# EAGLE design V0.2 (EAGLE 8.6.3)

## Sheet 1 of 3: This sheet contain connections for Power Source and +3.3 V regulator to enable communication.
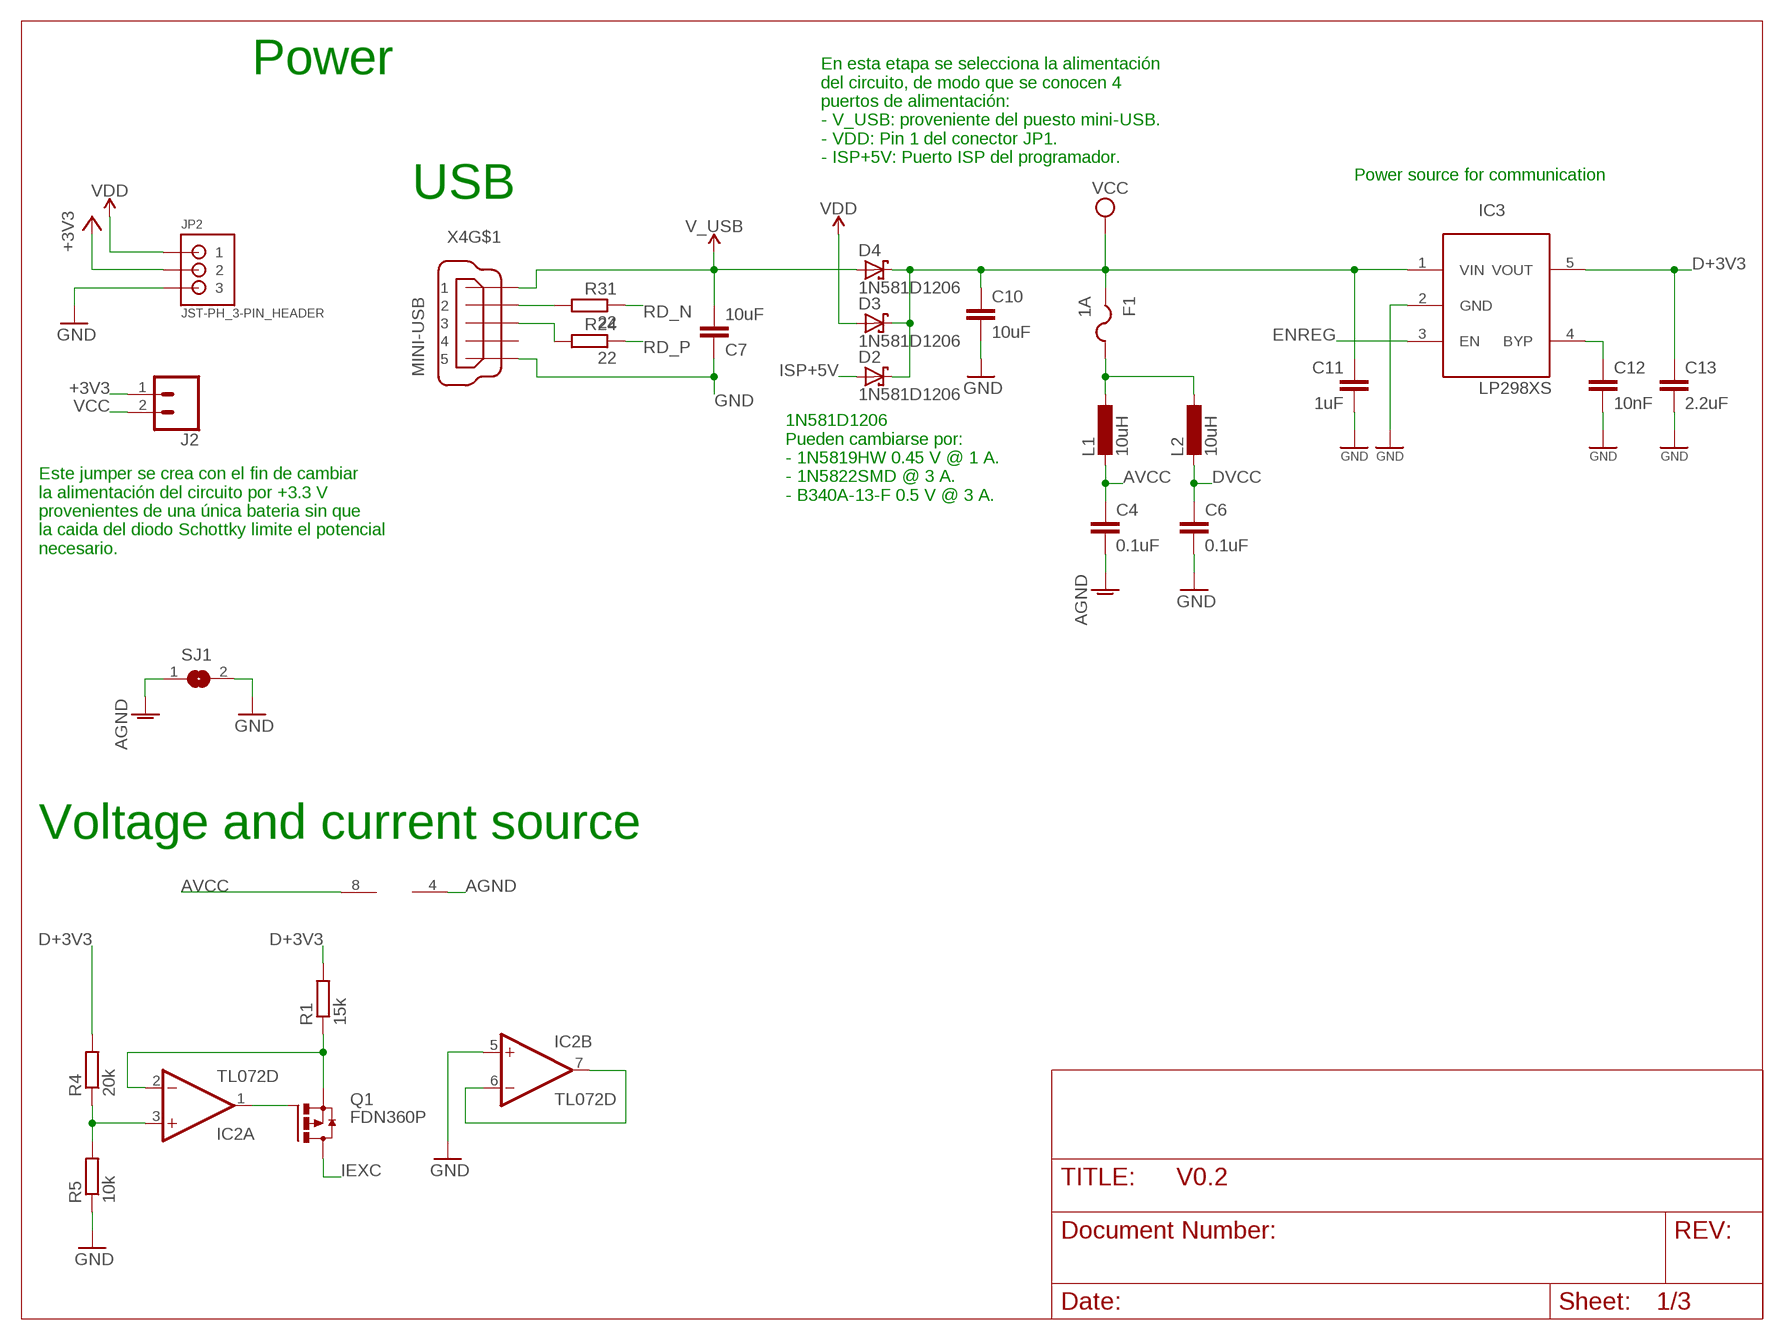
[diagram p0: schematic, sheet 1]

### Parts
C4  0.1uF  C-EUC0805  [C0805]
C6  0.1uF  C-EUC0805  [C0805]
C7  10uF  C-EUC0805  [C0805]
C10  10uF  C-EUC1206  [C1206]
C11  1uF  C-EUC0805  [C0805]
C12  10nF  C-EUC0805  [C0805]
C13  2.2uF  C-EUC0805  [C0805]
D2  1N581D1206  [LED-1206]
D3  1N581D1206  [LED-1206]
D4  1N581D1206  [LED-1206]
F1  1A  PTCFUSE-1812  [1812]
IC2  TL072D  [SO08]
IC3  LP298XS  [SOT23-5L]
J2  CONN_02  [1X02]
JP2  JST-PH_3-PIN_HEADER  [JST_B3B-PH_HEADER]
L1  10uH  L-EUL1812  [L1812]
L2  10uH  L-EUL1812  [L1812]
Q1  FDN360P  [SUPER-SOT3]
R1  15k  R-EU_R0805  [R0805]
R4  20k  R-EU_R0805  [R0805]
R5  10k  R-EU_R0805  [R0805]
R24  22  R-EU_R0805  [R0805]
R31  22  R-EU_R0805  [R0805]
SJ1  SJ  [SJ]
X4  MINI-USB  MINI-USB-SCHIELD-32005-201  [32005-201]

### Nets
+3V3 [power]: J2.1 JP2.P2
AGND: C4.2 IC2.4(P:V-) SJ1.1 ; also sheet 3
AVCC: C4.1 IC2.8(P:V+) L1.2
D+3V3 [power]: C13.1 IC3.5(VOUT) R1.2 R4.2 ; also sheet 3
D+USB: R24.2 X4.3
D-USB: R31.2 X4.2
DVCC: C6.1 L2.2 ; also sheet 2,3
ENREG: IC3.3(EN) ; also sheet 3
GND [power]: C6.2 C7.1 C10.2 C11.2 C12.2 C13.2 IC2.5(B:+IN) IC3.2(GND) JP2.P3 R5.1 SJ1.2 X4.5 ; also sheet 2,3
IEXC: Q1.3(D) ; also sheet 3
ISP+5V [power]: D2.A ; also sheet 3
N$1 [power]: F1.2 L1.1 L2.1
N$2: IC2.1(A:OUT) Q1.1(G)
N$4: IC2.3(A:+IN) R4.1 R5.2
N$5: IC2.2(A:-IN) Q1.2(S) R1.1
N$6: C12.1 IC3.4(BYP)
N$8: IC2.6(B:-IN) IC2.7(B:OUT)
RD_N: R31.1 ; also sheet 3
RD_P: R24.1 ; also sheet 3
V_USB [power]: C7.2 D4.A X4.1 ; also sheet 3
VCC [power]: C10.1 C11.1 D2.C D3.C D4.C F1.1 IC3.1(VIN) J2.2 ; also sheet 2
VDD [power]: D3.A JP2.P1
Unconnected: X4.4 X4.M1(S:S1) X4.M2(S:S2) X4.M3(S:S3) X4.M4(S:S4)

### Notes on the sheet
- Power
- En esta etapa se selecciona la alimentación 
  del circuito, de modo que se conocen 4
  puertos de alimentación:
  - V_USB: proveniente del puesto mini-USB.
  - VDD: Pin 1 del conector JP1.
  - ISP+5V: Puerto ISP del programador.
- Power source for communication
- USB
- 1N581D1206
  Pueden cambiarse por:
  - 1N5819HW 0.45 V @ 1 A.
  - 1N5822SMD @ 3 A.
  - B340A-13-F 0.5 V @ 3 A.
- Este jumper se crea con el fin de cambiar 
  la alimentación del circuito por +3.3 V 
  provenientes de una única bateria sin que 
  la caida del diodo Schottky limite el potencial 
  necesario.
- Voltage and current source

## Sheet 2 of 3: This sheet contain all conections for analog and digital sensors, display communication, antenna ports and conductive buttons for local configuration.
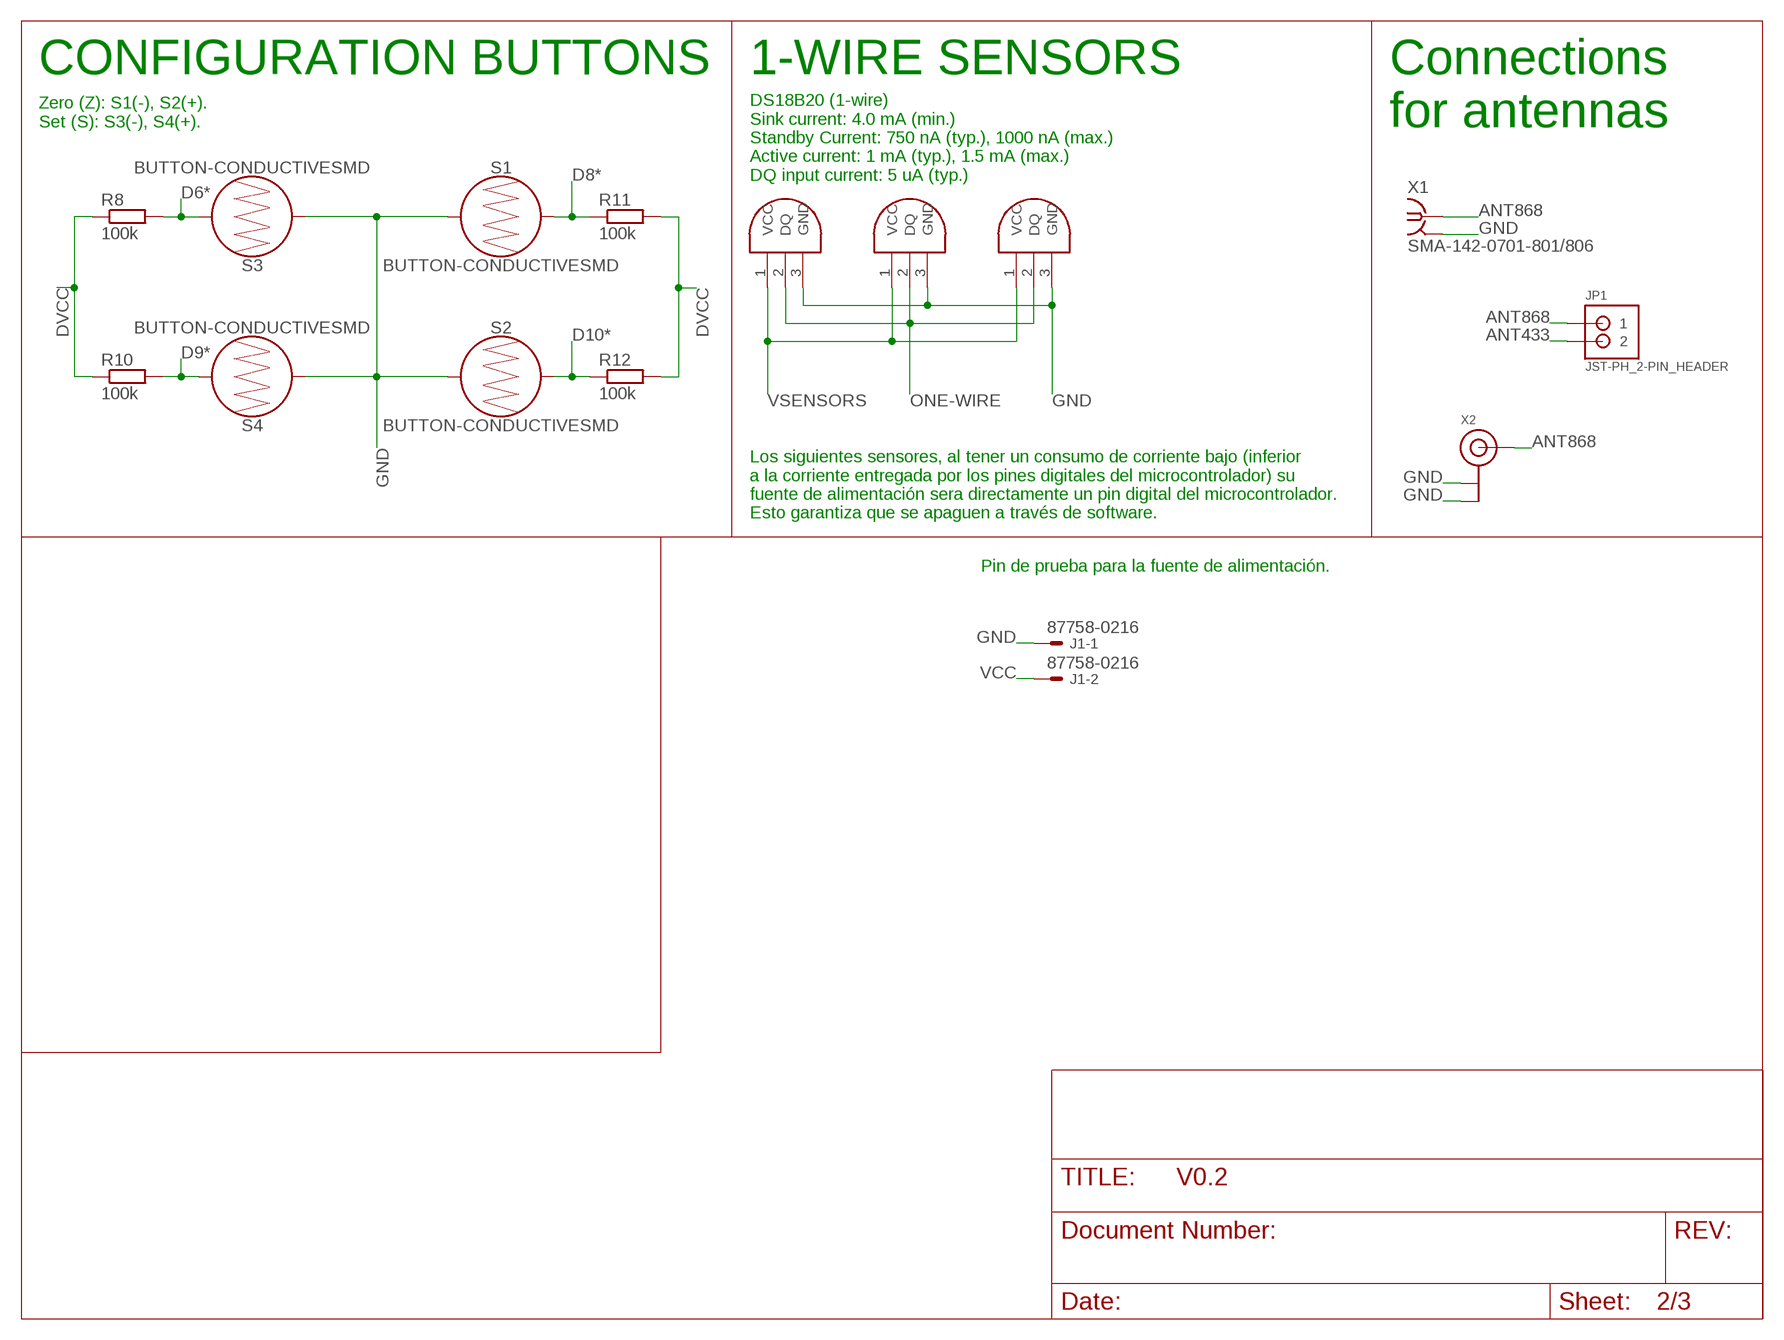
[diagram p1: schematic, sheet 2]

### Parts
J1  87758-0216  [87758-0216]
JP1  JST-PH_2-PIN_HEADER  [JST_B2B-PH_HEADER]
R8  100k  R-EU_R0805  [R0805]
R10  100k  R-EU_R0805  [R0805]
R11  100k  R-EU_R0805  [R0805]
R12  100k  R-EU_R0805  [R0805]
S1  BUTTON-CONDUCTIVESMD  [BUTTON-CONDUCTIVE]
S2  BUTTON-CONDUCTIVESMD  [BUTTON-CONDUCTIVE]
S3  BUTTON-CONDUCTIVESMD  [BUTTON-CONDUCTIVE]
S4  BUTTON-CONDUCTIVESMD  [BUTTON-CONDUCTIVE]
U$5  DS18B20_PINS  [3PINS_SMALL]
U$6  DS18B20_PINS  [3PINS_SMALL]
U$9  DS18B20_PINS  [3PINS_SMALL]
X1  SMA-142-0701-801/806  [J502-ND-142-0701-801/806]
X2  ANTENNA_U.FL  [U.FL]

### Nets
ANT433: JP1.P2 ; also sheet 3
ANT868: JP1.P1 X1.1 X2.3(SIGNAL) ; also sheet 3
D6*: R8.2 S3.2 ; also sheet 3
D8*: R11.1 S1.2 ; also sheet 3
D9*: R10.2 S4.2 ; also sheet 3
D10*: R12.1 S2.2 ; also sheet 3
DVCC: R8.1 R10.1 R11.2 R12.2 ; also sheet 1,3
GND [power]: J1.1 S1.1 S2.1 S3.1 S4.1 U$5.3(GND) U$6.3(GND) U$9.3(GND) X1.G@1 X1.G@2 X1.G@3 X1.G@4 X2.1(GND) X2.2(GND) ; also sheet 1,3
ONE-WIRE: U$5.2(DQ) U$6.2(DQ) U$9.2(DQ) ; also sheet 3
VCC [power]: J1.2 ; also sheet 1
VSENSORS: U$5.1(VCC) U$6.1(VCC) U$9.1(VCC) ; also sheet 3

### Notes on the sheet
- CONFIGURATION BUTTONS | 1-WIRE SENSORS
- Zero (Z): S1(-), S2(+).
  Set (S): S3(-), S4(+).
- Connections 
  for antennas
- DS18B20 (1-wire)
  Sink current: 4.0 mA (min.)
  Standby Current: 750 nA (typ.), 1000 nA (max.)
  Active current: 1 mA (typ.), 1.5 mA (max.)
  DQ input current: 5 uA (typ.)
- Los siguientes sensores, al tener un consumo de corriente bajo (inferior 
  a la corriente entregada por los pines digitales del microcontrolador) su 
  fuente de alimentación sera directamente un pin digital del microcontrolador. 
  Esto garantiza que se apaguen a través de software.
- Pin de prueba para la fuente de alimentación.

## Sheet 3 of 3: This sheet contain all the configuration neccesary for microcontroller ATmega32u4. All conections about source, reset and external clocks was included here.
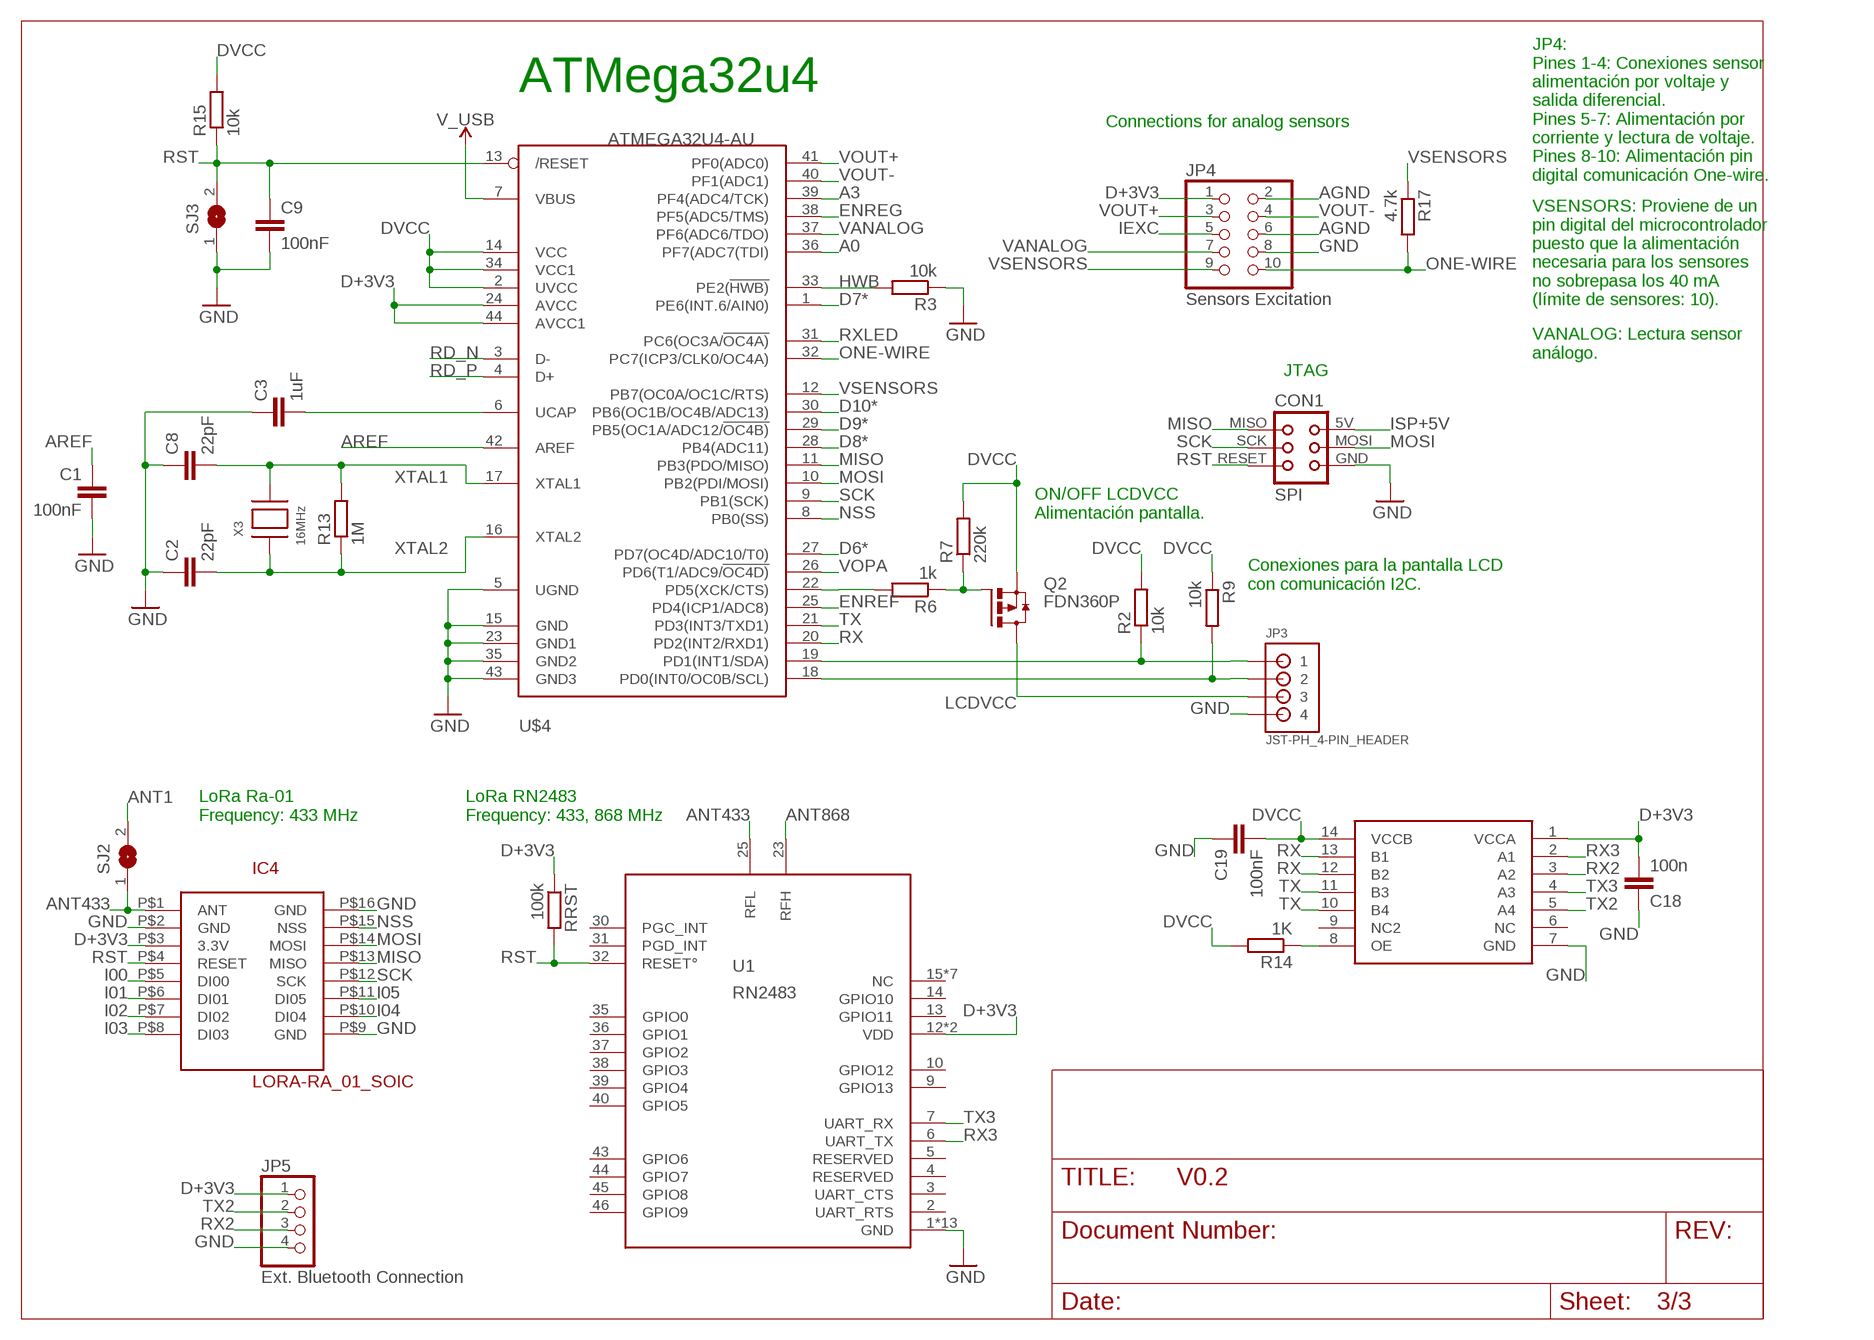
[diagram p2: schematic, sheet 3]

### Parts
C1  100nF  C-EUC0805  [C0805]
C2  22pF  C-EUC0805  [C0805]
C3  1uF  C-EUC0805  [C0805]
C8  22pF  C-EUC0805  [C0805]
C9  100nF  C-EUC0805  [C0805]
C18  100n  C-EUC0805  [C0805]
C19  100nF  C-EUC0805  [C0805]
CON1  SPI  TINYISPT  [TC2030-MCP-NL]
IC4  LORA-RA_01_SOIC  [LORA-RA_01]
JP3  JST-PH_4-PIN_HEADER  [JST_B4B-PH_HEADER]
JP4  Sensors Excitation  PINHD-2X5/90  [2X05/90]
JP5  Ext. Bluetooth Connection  PINHD-1X4  [1X04]
Q2  FDN360P  [SUPER-SOT3]
R2  10k  R-EU_R0805  [R0805]
R3  10k  R-EU_R0805  [R0805]
R6  1k  R-EU_R0805  [R0805]
R7  220k  R-EU_R0805  [R0805]
R9  10k  R-EU_R0805  [R0805]
R13  1M  R-EU_R0805  [R0805]
R14  1K  R-EU_R0805  [R0805]
R15  10k  R-EU_M0805  [M0805]
R17  4.7k  R-EU_R0805  [R0805]
RRST  100k  R-EU_R0805  [R0805]
SJ2  SJ  [SJ]
SJ3  SJ  [SJ]
U1  RN2483  [RN2483]
U$3  TXB0104  [SO14]
U$4  ATMEGA32U4-AU  [TQFP44]
X3  16MHz  XTALNX6035  [NX6035]

### Nets
A0: U$4.36(PF7(ADC7(TDI))
A3: U$4.39(PF4(ADC4/TCK))
AGND: JP4.2 JP4.6 ; also sheet 1
ANT1: SJ2.2
ANT433: IC4.P$1(ANT) SJ2.1 U1.25(RFL) ; also sheet 2
ANT868: U1.23(RFH) ; also sheet 2
AREF: C1.1 U$4.42(AREF)
D6*: U$4.27(PD7(OC4D/ADC10/T0)) ; also sheet 2
D7*: U$4.1(PE6(INT.6/AIN0))
D8*: U$4.28(PB4(ADC11)) ; also sheet 2
D9*: U$4.29(PB5(OC1A/ADC12/!OC4B)) ; also sheet 2
D10*: U$4.30(PB6(OC1B/OC4B/ADC13)) ; also sheet 2
D+3V3 [power]: C18.2 IC4.P$3(3.3V) JP4.1 JP5.1 RRST.1 U1.12(VDD) U1.34(VDD) U$3.1(VCCA) U$4.24(AVCC) U$4.44(AVCC1) ; also sheet 1
DVCC: C19.2 Q2.2(S) R2.2 R7.2 R9.1 R14.2 R15.2 U$3.14(VCCB) U$4.2(UVCC) U$4.14(VCC) U$4.34(VCC1) ; also sheet 1,2
ENLCD: R6.2 U$4.22(PD5(XCK/CTS))
ENREF: U$4.25(PD4(ICP1/ADC8))
ENREG: U$4.38(PF5(ADC5/TMS)) ; also sheet 1
GND [power]: C1.2 C2.1 C3.1 C8.1 C9.2 C18.1 C19.1 CON1.GND IC4.P$2(GND) IC4.P$9(GND) IC4.P$16(GND) JP3.P4 JP4.8 JP5.4 R3.1 SJ3.1 U1.1(GND) U1.8(GND) U1.11(GND) U1.20(GND) U1.21(GND) U1.22(GND) U1.24(GND) U1.26(GND) U1.27(GND) U1.28(GND) U1.33(GND) U1.41(GND) U1.47(GND) U$3.7(GND) U$4.5(UGND) U$4.15(GND) U$4.23(GND1) U$4.35(GND2) U$4.43(GND3) ; also sheet 1,2
HWB: R3.2 U$4.33(PE2(!HWB))
I00: IC4.P$5(DI00)
I01: IC4.P$6(DI01)
I02: IC4.P$7(DI02)
I03: IC4.P$8(DI03)
I04: IC4.P$10(DI04)
I05: IC4.P$11(DI05)
IEXC: JP4.5 ; also sheet 1
ISP+5V [power]: CON1.5V(VCC) ; also sheet 1
LCDVCC [power]: JP3.P3 Q2.3(D)
MISO: CON1.MISO IC4.P$13(MISO) U$4.11(PB3(PDO/MISO))
MOSI: CON1.MOSI IC4.P$14(MOSI) U$4.10(PB2(PDI/MOSI))
N$3: R14.1 U$3.8(OE)
N$7: Q2.1(G) R6.1 R7.1
NSS: IC4.P$15(NSS) U$4.8(PB0(SS))
ONE-WIRE: JP4.10 R17.2 U$4.32(PC7(ICP3/CLK0/OC4A)) ; also sheet 2
RD_N: U$4.3(D-) ; also sheet 1
RD_P: U$4.4(D+) ; also sheet 1
RST: C9.1 CON1.RESET IC4.P$4(RESET) R15.1 RRST.2 SJ3.2 U1.32(RESET°) U$4.13(/RESET)
RX: U$3.12(B2) U$3.13(B1) U$4.20(PD2(INT2/RXD1))
RX2: JP5.3 U$3.3(A2)
RX3: U1.6(UART_TX) U$3.2(A1)
RXLED: U$4.31(PC6(OC3A/!OC4A))
SCK: CON1.SCK IC4.P$12(SCK) U$4.9(PB1(SCK))
SCL: JP3.P2 R9.2 U$4.18(PD0(INT0/OC0B/SCL))
SDA: JP3.P1 R2.1 U$4.19(PD1(INT1/SDA))
TX: U$3.10(B4) U$3.11(B3) U$4.21(PD3(INT3/TXD1))
TX2: JP5.2 U$3.5(A4)
TX3: U1.7(UART_RX) U$3.4(A3)
UCAP: C3.2 U$4.6(UCAP)
V_USB [power]: U$4.7(VBUS) ; also sheet 1
VANALOG: JP4.7 U$4.37(PF6(ADC6/TDO))
VOPA: U$4.26(PD6(T1/ADC9/!OC4D))
VOUT+: JP4.3 U$4.41(PF0(ADC0))
VOUT-: JP4.4 U$4.40(PF1(ADC1))
VSENSORS: JP4.9 R17.1 U$4.12(PB7(OC0A/OC1C/RTS)) ; also sheet 2
XTAL1: C8.2 R13.2 U$4.17(XTAL1) X3.P$2
XTAL2: C2.2 R13.1 U$4.16(XTAL2) X3.P$1
Unconnected: U1.2(UART_RTS) U1.3(UART_CTS) U1.4(RESERVED) U1.5(RESERVED) U1.9(GPIO13) U1.10(GPIO12) U1.13(GPIO11) U1.14(GPIO10) U1.15(NC) U1.16(NC) U1.17(NC) U1.18(NC) U1.19(NC) U1.29(NC) U1.30(PGC_INT) U1.31(PGD_INT) U1.35(GPIO0) U1.36(GPIO1) U1.37(GPIO2) U1.38(GPIO3) U1.39(GPIO4) U1.40(GPIO5) U1.42(NC) U1.43(GPIO6) U1.44(GPIO7) U1.45(GPIO8) U1.46(GPIO9) U$3.6(NC) U$3.9(NC2)

### Notes on the sheet
- ATMega32u4
- Connections for analog sensors
- JP4:
  Pines 1-4: Conexiones sensor 
  alimentación por voltaje y 
  salida diferencial.
  Pines 5-7: Alimentación por 
  corriente y lectura de voltaje.
  Pines 8-10: Alimentación pin 
  digital comunicación One-wire.
- VSENSORS: Proviene de un 
  pin digital del microcontrolador 
  puesto que la alimentación 
  necesaria para los sensores 
  no sobrepasa los 40 mA 
  (límite de sensores: 10).
- VANALOG: Lectura sensor 
  análogo.
- JTAG
- ON/OFF LCDVCC
  Alimentación pantalla.
- Conexiones para la pantalla LCD
  con comunicación I2C.
- LoRa Ra-01
  Frequency: 433 MHz
- LoRa RN2483
  Frequency: 433, 868 MHz

## Library data of the parts
C1 C3 C4 C6-C9 C11-C13 C18 C19 = rcl:C-EU: CAPACITOR, European symbol; SPICEPREFIX: C
C2 C10 = rcl:C-EU: CAPACITOR, European symbol
CON1 = lpatiny:TINYISP: CONNECTOR
D2-D4 = lpatiny:1N581*: 1.0A SCHOTTKY BARRIER RECTIFIER Source: http://www.diodes.com/datasheets/ds23001.pdf
F1 = adafruit:PTCFUSE: PTC fuses, resettable thermistors
IC2 = linear:TL072: OP AMP; SPICEPREFIX: J
IC3 = adafruit:LP298X
IC4 = LORA-RA_01:LORA-RA_01_SOIC
J1 = con-molex:87758-0216: 2 Pin - 2mm Dual Row Single Wafer, Vertical T/H HDR Source: http://www.molex.com/pdm_docs/sd/877580616_sd.pdf; MF: MOLEX; MPN: 87758-0216; OC_FARNELL: unknown; OC_NEWARK: 94M1513
J2 = SparkFun-Connectors:CONN_02: Multi connection point. Often used as Generic Header-pin footprint for 0.1 inch spaced/style header connections On any of the 0.1 inch spaced packages, you can populate with these: Break Away Headers - Straight <https://www.sparkfun.com/products/116> (PRT-00116) Break Away Male Headers - Right Angle <https://www.sparkfun.com/products/553> (PRT-00553) Female Headers <https://www.sparkfun.com/products/115> (PRT-00115) Break Away Headers - Machine Pin <https://www.sparkfun.com/products/117> (PRT-00117) Break Away Female Headers - Swiss Machine Pin <https://www.sparkfun.com/products/743> (PRT-00743) For SCREWTERMINALS and SPRING TERMINALS visit here: Screw Terimnals on SparkFun.com <https://www.sparkfun.com/search/results?term=Screw+Terminals> (5mm/3.5mm/2.54mm spacing) This device is also useful as a general connection point to wire up your design to another part of your project. Our various solder wires solder well into these plated through hole pads. Hook-Up Wire - Assortment (Stranded, 22 AWG) <https://www.sparkfun.com/products/11375> (PRT-11375) Hook-Up Wire - Assortment (Solid Core, 22 AWG) <https://www.sparkfun.com/products/11367> (PRT-11367) View the entire wire category on our website here <https://www.sparkfun.com/categories/141> Special notes: Molex polarized connector foot print use with: PRT-08233 with associated crimp pins and housings. 2.54_SCREWTERM for use with PRT-10571. 3.5mm Screw Terminal footprints for PRT-08084 5mm Screw Terminal footprints for use with PRT-08432
JP1 = SRG:JST-PH_2-PIN_HEADER: 2-pin JST PH Shrouded Header, top entry P/N B2B-PH-K-S Mating connector PHR-2 Mating cable assembly: Sparkfun PRT-09914 <http://www.sparkfun.com/products/9914>
JP2 = SRG:JST-PH_3-PIN_HEADER: 3-pin JST PH Shrouded Header, top entry P/N B3B-PH-K-S Mating connector PHR-3
JP3 = SRG:JST-PH_4-PIN_HEADER: 4-pin JST PH Shrouded Header, top entry P/N B4B-PH-K-S Mating connector PHR-4 Mating cable assembly: Sparkfun PRT-09916 <http://www.sparkfun.com/products/9916>
JP4 = pinhead:PINHD-2X5: PIN HEADER
JP5 = pinhead:PINHD-1X4: PIN HEADER
L1 L2 = rcl:L-EU: INDUCTOR, European symbol; SPICEPREFIX: L
Q1 Q2 = transistor-power:FDN360P: Single P-Channel, PowerTrench (R) MOSFET Source: http://www.fairchildsemi.com/ds/FD/FDN360P.pdf
R1-R13 R17 R24 R31 = rcl:R-EU_: RESISTOR, European symbol; SPICEPREFIX: R
R14 RRST = rcl:R-EU_: RESISTOR, European symbol
R15 = resistor:R-EU_: RESISTOR, European symbol
S1-S4 = SparkFun-Switches:BUTTON-CONDUCTIVE: Conductive Button Used with rubber key pads on the Nordic Key FOB <https://www.sparkfun.com/products/retired/8602>. This one was designed and proven to work with the PolyCase Key FOB enclosures <https://www.sparkfun.com/products/retired/9377>. SparkFun Products Nordic Fob <https://www.sparkfun.com/products/retired/8602> (WRL-08602)
SJ1-SJ3 = jumper:SJ: SMD solder JUMPER
U1 = tobias:RN2483: RN2483 Microchip Low-Power Lora Transceiver Module NOT TESTED There are testpads on the bottom of the device. The mask is supposed to cover that, but I have not tested it in practice yet. Info: http://www.microchip.com/wwwproducts/Devices.aspx?product=RN2483 Datasheet: http://ww1.microchip.com/downloads/en/DeviceDoc/50002346B.pdf Adapted from: https://github.com/Octanis1/Octanis1-Electronics/blob/ae493cac28c100e20856abe563dfe8824e9cc4bd/lib/Octanis1.lbr
U$3 = lpatiny:TXB0104: TXB0104 4-Bit Bidirectional Voltage-level Translator With Automatic Direction Sensing and ±15-kV ESD Protection
U$4 = adafruit:ATMEGA32U4: http://www.ladyada.net/library/eagle
U$5 U$6 U$9 = lpatiny:DS18B20_PINS
X1 = con-coax:SMA-: SMA 50 Ohm End Launch Jack Receptacle - Round Contact Johnson Components Source: www.johnsoncomponents.com .. J502-ND.pdf; MF: JOHNSON COMPONENTS; MPN: 142-0701-801; OC_FARNELL: 1608592; OC_NEWARK: 90F2624
X2 = adafruit:ANTENNA_U.FL: U.FL Antenna Connector
X3 = lpatiny:XTAL: Low cost SMT crystals, no capacitors included http://www.ladyada.net/library/eagle
X4 = con-cypressindustries:MINI-USB-SCHIELD-: MINI USB-B Conector Source: www.cypressindustries.com; OC_FARNELL: unknown; OC_NEWARK: unknown

## Net classes
0 default: width 0.203 mm
1 power: width 0.203 mm, drill 0.305 mm, clearance 0.152 mm
2 VIN: width 0.457 mm
3 fine: width 0.305 mm
4 aref: width 0.305 mm

## Board
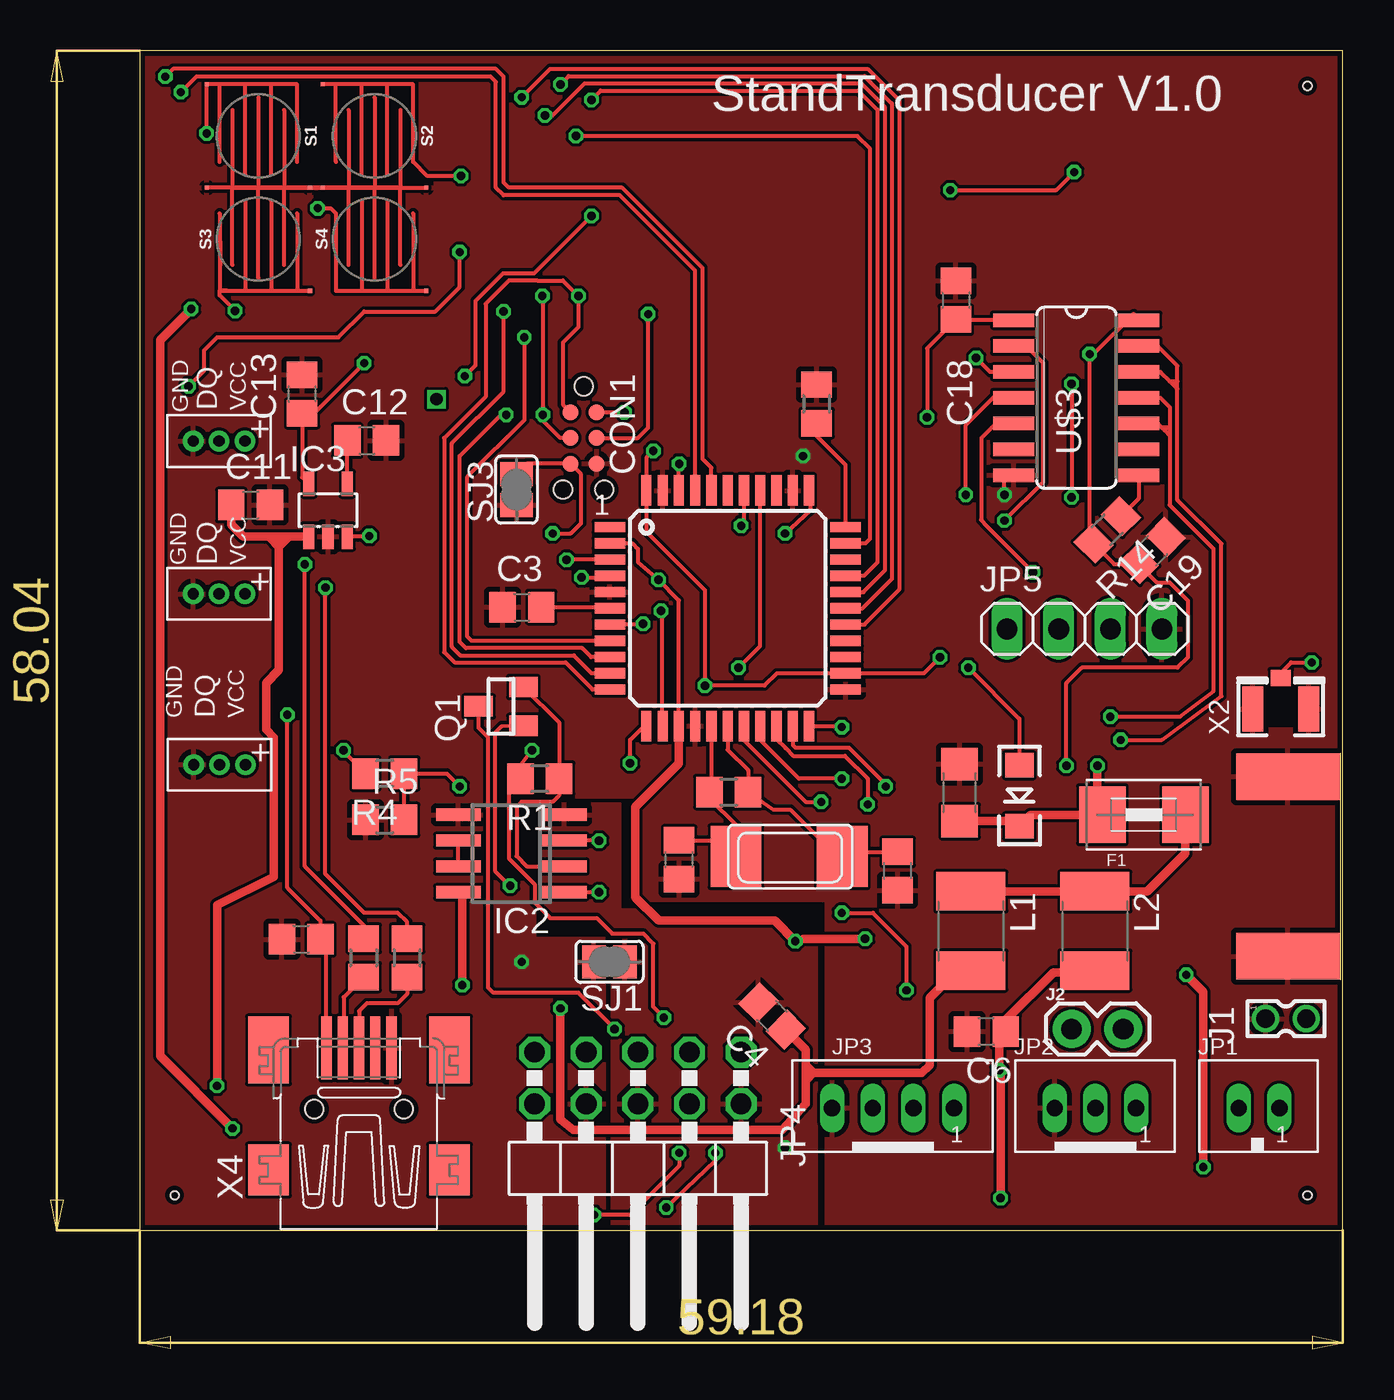
[diagram p3: board, top side]
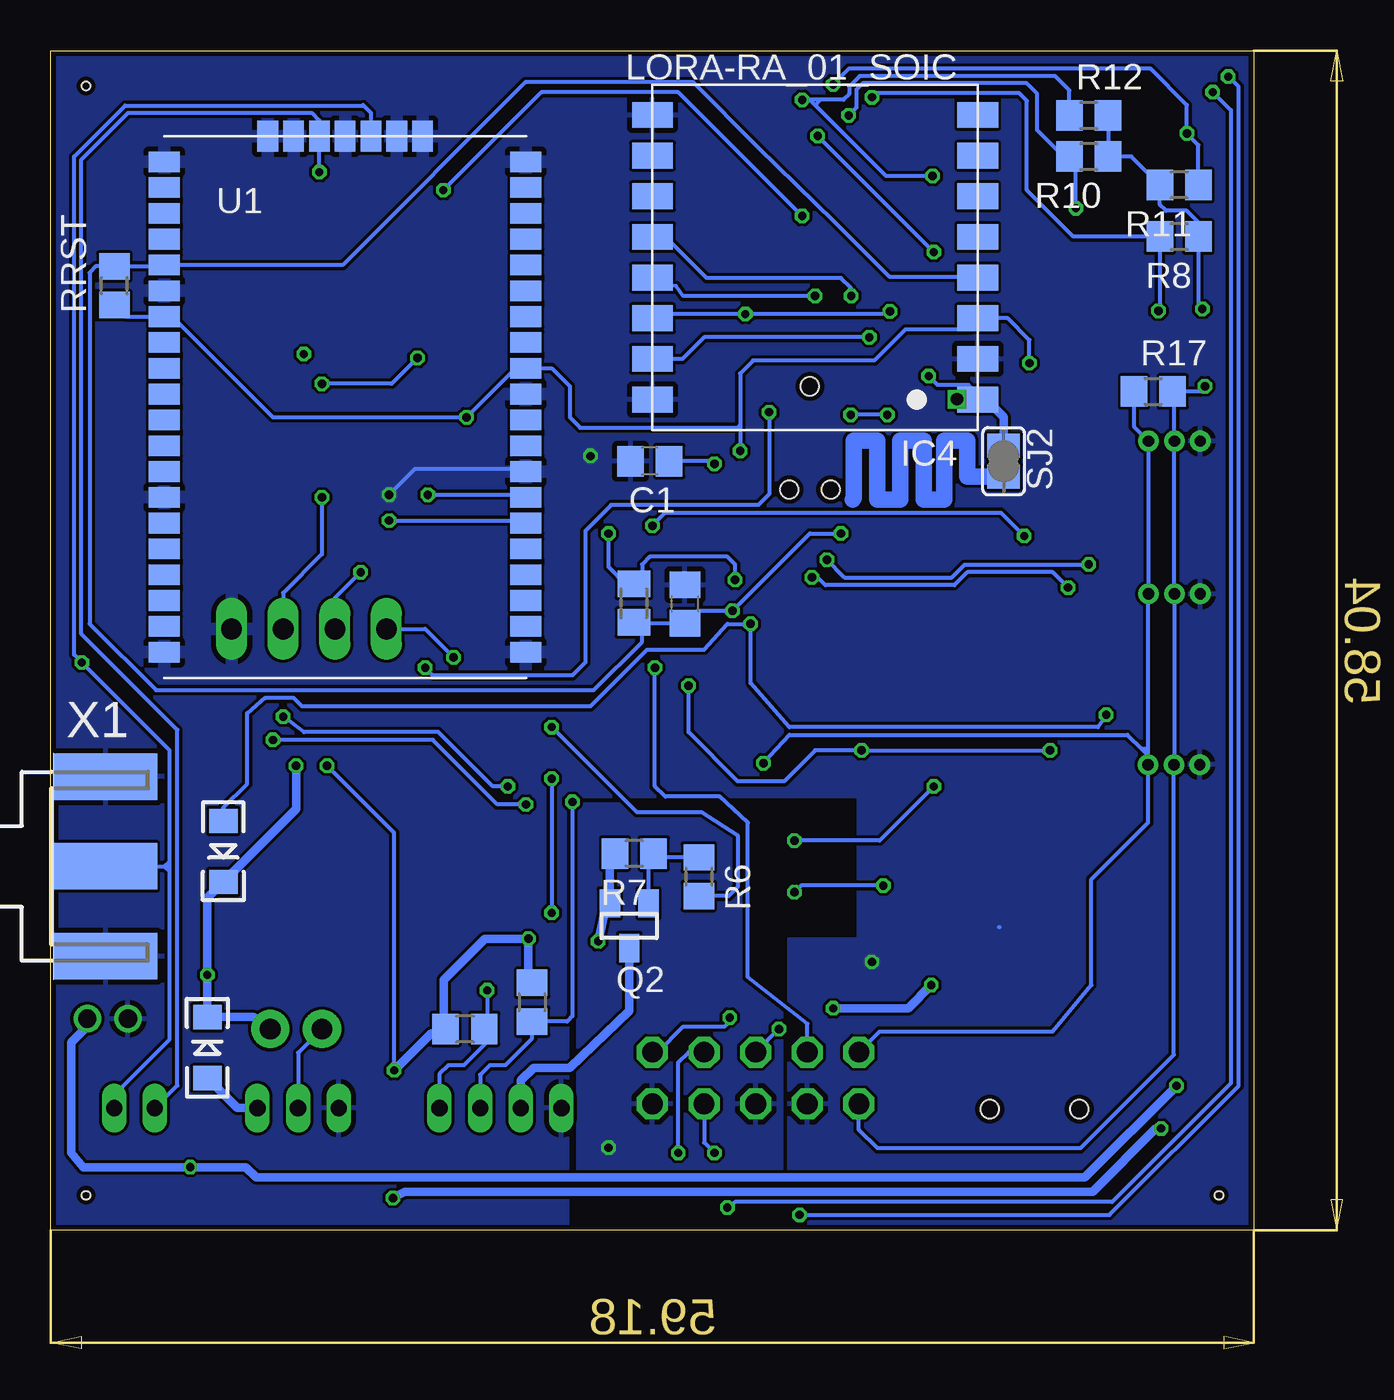
[diagram p4: board, bottom side, seen from below]

Size 59.18 x 58.04 mm. Coordinates in mm from the lower left corner, seen from the top.
Outline: 0,0 59.18,0 59.18,58.04 0,58.04 0,0
Copper layers (1*16): Top 0.035mm / dielectric 1.5mm / Bottom 0.035mm
Design rules "Fusion_eagle_rule_v1.1 *": minimum track width 8mil, minimum drill 16mil, track to track 6mil, track to pad 6mil, pad to pad 6mil, via to via 6mil, smd to smd 0mil, copper to edge 10mil, drill to drill 10mil, minimum pad ring 6mil, minimum via ring 6mil, stop-mask expansion 2mil, vias tented up to drill 100mil, thermal gap 10mil
Holes 0.41 mm at 57.45,1.73 1.73,1.73 57.45,56.31
vRestrict: area 24.5,23.9 to 33.4,25.8; area 20.2,35.8 to 23.5,42.2; area 24.5,35.3 to 33.3,37.3; area 33.7,26.2 to 35.7,35.1; area 22.1,26.2 to 24.1,35.1

### Footprints (pad centres in the part's own frame; a part is rotated, then mirrored left to right if it is on the bottom)
C0805 = smd 1.3 x 1.5: 1 -0.95,0; 2 0.95,0
C1206 = smd 1.6 x 1.8: 1 -1.4,0; 2 1.4,0
TC2030-MCP-NL = smd 0.787 x 0.787: 5V 1.27,0.635; GND 3.81,0.635; MISO 1.27,-0.635; MOSI 2.54,0.635; RESET 3.81,-0.635; SCK 2.54,-0.635 | hole 0.889: 0,0; 5.08,-1.016; 5.08,1.016
LED-1206 = smd 1.2 x 1.4: A -1.5,0; C 1.5,0
1812 = smd 2.286 x 2.794: 1 -2.046,0; 2 2.046,0
SO08 = smd 0.6 x 2.2: 1 -1.905,-2.6; 2 -0.635,-2.6; 3 0.635,-2.6; 4 1.905,-2.6; 5 1.905,2.6; 6 0.635,2.6; 7 -0.635,2.6; 8 -1.905,2.6
SOT23-5L = smd 0.55 x 1.2: 1 -0.95,-1.3; 2 0,-1.3; 3 0.95,-1.3; 4 0.95,1.3; 5 -0.95,1.3
LORA-RA_01 = smd 2 x 1.27: P$1 -8,7; P$2 -8,5; P$3 -8,3; P$4 -8,1; P$5 -8,-1; P$6 -8,-3; P$7 -8,-5; P$8 -8,-7; P$9 8,-7; P$10 8,-5; P$11 8,-3; P$12 8,-1; P$13 8,1; P$14 8,3; P$15 8,5; P$16 8,7 | drill 0.6 square: P$17 -6.985,6.985
87758-0216 = drill 0.9 pad 1.27: 1 0,-1; 2 0,1
1X02 = drill 1.016 pad 1.88: 1 0,0; 2 2.54,0
JST_B2B-PH_HEADER = drill 0.8 long: P1 1.075,0.048; P2 -0.925,0.048
JST_B3B-PH_HEADER = drill 0.8 long: P1 2.027,0.048; P2 0.028,0.048; P3 -1.972,0.048
JST_B4B-PH_HEADER = drill 0.8 long: P1 2.98,0.048; P2 0.98,0.048; P3 -1.02,0.048; P4 -3.02,0.048
2X05/90 = drill 1.016 octagon: 1 -5.08,-6.35; 2 -5.08,-3.81; 3 -2.54,-6.35; 4 -2.54,-3.81; 5 0,-6.35; 6 0,-3.81; 7 2.54,-6.35; 8 2.54,-3.81; 9 5.08,-6.35; 10 5.08,-3.81
1X04 = drill 1.016 long: 1 -3.81,0; 2 -1.27,0; 3 1.27,0; 4 3.81,0
L1812 = smd 1.9 x 3.4: 1 -1.95,0; 2 1.95,0
SUPER-SOT3 = smd 1 x 1.4: 1 -0.95,-1.1; 2 0.95,-1.1; 3 0,1.1
R0805 = smd 1.3 x 1.5: 1 -0.95,0; 2 0.95,0
M0805 = smd 1.3 x 1.6: 1 -0.95,0; 2 0.95,0
BUTTON-CONDUCTIVE = smd 0.203 x 0.203: 1 2.54,2.54; 2 2.54,-2.54
SJ = smd 1.168 x 1.6: 1 -0.762,0; 2 0.762,0
RN2483 = smd 1.524 x 1.016: 1 17.78,1.27; 2 17.78,2.54; 3 17.78,3.81; 4 17.78,5.08; 5 17.78,6.35; 6 17.78,7.62; 7 17.78,8.89; 8 17.78,10.16; 9 17.78,11.43; 10 17.78,12.7; 11 17.78,13.97; 12 17.78,15.24; 13 17.78,16.51; 14 17.78,17.78; 15 17.78,19.05; 16 17.78,20.32; 17 17.78,21.59; 18 17.78,22.86; 19 17.78,24.13; 20 17.78,25.4; 28 0,25.4; 29 0,24.13; 30 0,22.86; 31 0,21.59; 32 0,20.32; 33 0,19.05; 34 0,17.78; 35 0,16.51; 36 0,15.24; 37 0,13.97; 38 0,12.7; 39 0,11.43; 40 0,10.16; 41 0,8.89; 42 0,7.62; 43 0,6.35; 44 0,5.08; 45 0,3.81; 46 0,2.54; 47 0,1.27 | smd 1.016 x 1.524: 21 12.7,26.67; 22 11.43,26.67; 23 10.16,26.67; 24 8.89,26.67; 25 7.62,26.67; 26 6.35,26.67; 27 5.08,26.67
SO14 = smd 0.66 x 2.032: 1 -3.81,-3.073; 2 -2.54,-3.073; 3 -1.27,-3.073; 4 0,-3.073; 5 1.27,-3.073; 6 2.54,-3.073; 7 3.81,-3.073; 8 3.81,3.073; 9 2.54,3.073; 10 1.27,3.073; 11 0,3.073; 12 -1.27,3.073; 13 -2.54,3.073; 14 -3.81,3.073
TQFP44 = smd 1.5 x 0.5: 1 -5.8,4; 2 -5.8,3.2; 3 -5.8,2.4; 4 -5.8,1.6; 5 -5.8,0.8; 6 -5.8,0; 7 -5.8,-0.8; 8 -5.8,-1.6; 9 -5.8,-2.4; 10 -5.8,-3.2; 11 -5.8,-4; 23 5.8,-4; 24 5.8,-3.2; 25 5.8,-2.4; 26 5.8,-1.6; 27 5.8,-0.8; 28 5.8,0; 29 5.8,0.8; 30 5.8,1.6; 31 5.8,2.4; 32 5.8,3.2; 33 5.8,4 | smd 0.5 x 1.5: 12 -4,-5.8; 13 -3.2,-5.8; 14 -2.4,-5.8; 15 -1.6,-5.8; 16 -0.8,-5.8; 17 0,-5.8; 18 0.8,-5.8; 19 1.6,-5.8; 20 2.4,-5.8; 21 3.2,-5.8; 22 4,-5.8; 34 4,5.8; 35 3.2,5.8; 36 2.4,5.8; 37 1.6,5.8; 38 0.8,5.8; 39 0,5.8; 40 -0.8,5.8; 41 -1.6,5.8; 42 -2.4,5.8; 43 -3.2,5.8; 44 -4,5.8
3PINS_SMALL = drill 0.559 pad 1.016: 1 -1.27,0; 2 0,0; 3 1.27,0
J502-ND-142-0701-801/806 = smd 5.08 x 2.286: 1 2.565,0; G@1 2.565,4.42; G@2 2.565,-4.42 | smd 5.08 x 2.286 bottom: G@3 2.565,4.42; G@4 2.565,-4.42
U.FL = smd 2.2 x 1.05: 1 0,1.375; 2 0,-1.375 | smd 0.8 x 1: 3 1.525,0
NX6035 = smd 2.5 x 3: P$1 2.665,0; P$2 -2.565,0
32005-201 = smd 3.1 x 0.5: 1 3,1.6; 2 3,0.8; 3 3,0; 4 3,-0.8; 5 3,-1.6 | smd 2.5 x 2: M1 -3,-4.45; M2 -3,4.45 | smd 3.3 x 2: M3 2.9,4.45; M4 2.9,-4.45 | hole 0.9: 0,2.2; 0,-2.2

### Placement (x,y rotation side)
C1  29.72,37.85 180 bottom
C2  26.54,18.24 90 top
C3  18.81,30.66 0 top
C4  31.11,10.54 135 top
C6  41.66,9.78 180 top
C7  7.95,14.33 0 top
C8  37.29,17.68 90 top
C9  27.99,30.81 90 bottom
C10  40.34,21.54 90 top
C11  5.46,35.69 0 top
C12  11.18,38.86 0 top
C13  8,41.15 90 top
C18  40.16,45.77 270 top
C19  49.81,33.45 225 top
CON1  21.84,41.53 270 top
D2  43.28,21.39 270 top
D3  51.49,8.99 90 bottom
D4  50.7,18.64 270 bottom
F1  49.4,20.45 0 top
IC2  18.29,18.54 90 top
IC3  9.27,35.43 0 top
IC4  21.59,47.88 180 bottom
J1  56.39,10.41 270 top
J2  45.85,9.91 0 top
JP1  54.99,5.97 0 top
JP2  46.99,5.97 0 top
JP3  37.08,5.97 0 top
JP4  24.51,2.41 180 top
JP5  46.48,29.59 0 top
L1  40.89,14.73 270 top
L2  46.99,14.73 270 top
Q1  17.78,25.78 90 top
Q2  30.73,14.99 180 bottom
R1  19.68,22.23 180 top
R2  38.81,9.91 180 bottom
R3  33.3,40.67 270 top
R4  12.06,22.48 180 top
R5  12.06,20.19 0 top
R6  27.3,17.4 270 bottom
R7  30.48,18.54 180 bottom
R8  3.68,48.9 180 bottom
R9  35.51,11.23 270 bottom
R10  8.13,52.83 180 bottom
R11  3.68,51.44 180 bottom
R12  8.13,54.86 0 bottom
R13  28.98,21.56 0 top
R14  47.6,34.47 225 top
R15  30.51,30.86 90 bottom
R17  4.95,41.27 0 bottom
R24  13.16,13.41 270 top
R31  11.02,13.41 270 top
RRST  56.06,46.48 90 bottom
S1  5.84,53.85 180 top
S2  11.56,53.85 180 top
S3  5.84,48.77 0 top
S4  11.56,48.77 0 top
SJ1  23.11,13.21 180 top
SJ2  12.32,37.85 270 bottom
SJ3  18.54,36.45 90 top
U1  53.59,27.18 0 bottom
U$3  46.08,40.97 270 top
U$4  28.93,30.61 0 top
U$5  3.91,31.32 180 top
U$6  3.91,38.84 180 top
U$9  3.94,22.91 180 top
X1  59.05,17.91 0 bottom
X2  56.13,25.65 90 top
X3  32,18.39 180 top
X4  10.79,5.97 90 top

### Tracks (layer width: path | path; a pad name or v marks a point on that pad's centre or on a via)
+3V3
  Bottom 0.203: J2.1 47.02,8.74 JP2.P2
AGND  (via drill 0.41)
  other vias: 31.75,4.06
  pour Bottom: 23.24,0 23.24,14.73 19.81,14.73 19.81,20.95 33.27,20.95 33.27,0
  pour Top: 23.24,0 33.27,0 33.27,15.75 23.62,15.75 23.62,20.95 19.81,20.95 19.81,14.73 23.24,14.73
ANT1
  Bottom 0.813: SJ2.2 14.1,37.08 14.1,38.86 15.24,38.86 15.24,35.97 16.26,35.97 16.26,38.86 17.4,38.86 17.4,35.97 18.54,35.97 18.54,38.86 19.68,38.86 19.68,36.03 19.75,35.97
ANT433  (via drill 0.41)
  Top 0.203: v16,42.04 16.54,42.57 16.54,45.74 17.89,47.09 19.4,47.09 v22.23,49.91 | v39.88,51.18 45.09,51.18 v45.97,52.07
  Bottom 0.203: JP1.P2 52.96,7.12 52.96,24.62 57.68,29.34 57.68,52.69 55.38,54.99 46.35,54.99 45.97,54.61 U1.25 v45.97,52.07 | IC4.P$1 13.9,41.19 13.9,41.45 14.05,41.6 15.56,41.6 v16,42.04 | v22.23,49.91 28.32,56 35.06,56 v39.88,51.18
  Bottom 0.406: 13.19,40.88 12.32,40.01 SJ2.1
  Bottom 0.813: IC4.P$1 13.19,40.88
ANT868  (via drill 0.41)
  Top 0.203: X2.3 56.13,27.43 56.64,27.94 v57.66,27.94
  Bottom 0.203: 43.81,53.98 U1.23 43.43,54.99 43.81,55.37 43.84,55.35 55.52,55.35 58.04,52.83 58.04,28.32 v57.66,27.94 53.34,23.62 53.34,18.16 | JP1.P1 56.07,6.67 53.34,9.4 53.34,17.65 | 53.34,17.65 53.34,17.91 | 53.34,17.91 53.34,18.16 | X1.1 53.59,17.91 | 53.59,17.91 53.34,17.65 | 53.59,17.91 53.34,18.16 | 53.59,17.91 53.34,17.91
AREF  (via drill 0.41)
  Top 0.203: U$4.42 26.53,37.71 v26.54,37.72
  Bottom 0.203: v26.54,37.72 26.67,37.85 C1.1
AVCC  (via drill 0.41)
  Top 0.406: v15.88,12.06 15.88,16.51 IC2.8 | v20.7,10.92 20.7,5.46 21.34,4.95 31.62,4.95 32.77,6.22 32.77,7.24 | C4.1 32.77,8.89 32.77,8.13 | 32.77,7.24 | 32.77,7.24 32.77,7.75 | 32.77,7.75 32.77,8.13 | 33.15,7.75 38.48,7.75 38.86,8.13 38.86,11.43 40.21,12.78 L1.2 | 33.15,7.75 32.77,7.75 | 32.77,7.24 32.77,7.37 33.15,7.75 | 33.15,7.75 | 33.15,7.75 32.77,8.13
  Bottom 0.406: v20.7,10.92 17.02,10.92 v15.88,12.06
D6*  (via drill 0.41)
  Top 0.203: 4.32,46.23 3.94,46.23 | 34.61,29.84 U$4.27 | 3.97,48.67 3.94,46.23 | 34.69,29.84 U$4.27 | U$4.27 35.65,29.81 37.36,31.52 37.36,55.6 35.81,57.15 20.19,57.15 v18.8,55.75 | v4.7,45.24 3.94,46.01 3.94,46.23
  Bottom 0.203: v4.7,45.24 4.63,45.31 R8.2 8.89,48.9 11.18,51.18 11.18,55.58 11.56,55.96 18.59,55.96 v18.8,55.75
D8*  (via drill 0.41)
  Top 0.203: 34.59,30.66 34.61,30.64 U$4.28 35.56,30.61 37.01,32.05 37.01,55.44 35.65,56.79 21.11,56.79 v20.7,56.39 | v3.3,53.98 S1.2
  Bottom 0.203: R11.1 2.73,53.41 v3.3,53.98 3.3,55.37 5.08,57.15 19.94,57.15 v20.7,56.39
D9*  (via drill 0.41)
  Top 0.203: 34.69,31.37 U$4.29 35.6,31.41 36.65,32.46 36.65,55.29 35.5,56.44 21.89,56.44 20.32,54.86 v19.94,54.86 | v8.76,50.29 9.4,50.29 9.65,50.04
  Bottom 0.203: 9.21,53.18 9.13,52.97 | 9.13,52.97 R10.2 8.76,52.52 v8.76,50.29 | 9.13,52.97 9.5,52.97 10.67,54.13 10.67,55.93 11.18,56.44 19.25,56.44 19.56,56.13 19.56,55.24 v19.94,54.86
D10*  (via drill 0.41)
  Top 0.203: 34.77,32.07 U$4.30 35.64,32.21 36.3,32.87 36.3,55.14 35.36,56.08 22.68,56.08 v22.23,55.63 | v15.81,51.88 14.16,51.88 13.46,52.58
  Bottom 0.203: R12.1 9.08,56.09 9.78,56.79 19.4,56.79 19.91,56.28 19.91,55.91 20.19,55.63 21.34,55.63 | 21.34,55.63 21.84,55.63 | 21.84,55.63 v22.23,55.63 | v15.81,51.88 18.1,51.88 21.59,55.37 | 21.59,55.37 21.84,55.63 | 21.59,55.37 21.34,55.63
D+3V3  (via drill 0.41)
  Top 0.203: v19.3,23.62 18.73,22.86 R1.2 18.19,21.68 18.19,18.27 19.43,17.02 19.43,16.13 20.19,15.37 22.48,15.37 23.24,14.61 24.77,14.61 25.27,14.1 25.27,10.98 v25.79,10.47 | 34.29,27.3 U$4.24 | 24.89,36.45 U$4.44 | U$4.44 24.93,34.38 27.81,31.5 v27.81,26.8 30.73,26.8 31.34,27.41 U$4.24 | U$3.1 40.2,44.78 C18.2 38.73,43.4 v38.73,40.01 | v39.37,28.19 38.58,27.41 U$4.24 | IC3.5 8,37.05 C13.1 8.57,40.2 v11.05,42.67 | v25.27,38.35 24.93,38.01 U$4.44 | v10.03,23.62 10.03,23.56 R4.2
  Bottom 0.203: v27.81,26.8 27.81,24.51 25.4,22.1 23.11,22.1 21.59,23.62 v19.3,23.62 v10.03,23.62 | JP4.1 29.34,8.76 28.07,10.03 26.04,10.03 25.78,10.29 v25.78,10.46 v25.79,10.47 | RRST.1 55.48,44.96 U1.34 53.34,45.09 48.26,40.01 v38.73,40.01 36.2,42.55 U1.12 34.54,42.42 33.66,41.53 33.66,40.01 33.15,39.5 25.4,39.5 | JP5.1 40.77,29.59 v39.37,28.19 | 25.27,39.62 25.27,39.37 | 25.4,39.5 25.27,39.37 | 25.4,39.5 25.27,39.62 | v11.05,42.67 11.05,43.81 12.11,44.88 IC4.P$3 13.97,44.32 17.14,44.32 18.67,42.8 24.64,42.8 25.27,42.16 25.27,39.62 | 25.27,39.37 v25.27,38.35
D+USB
  Top 0.203: R24.2 13.16,11.63 12.7,11.18 11.18,11.18 10.79,10.79 X4.3
D-USB
  Top 0.203: 9.88,9.08 X4.2 10.03,9.01 10.03,11.47 R31.2
DVCC  (via drill 0.41)
  Top 0.203: U$3.14 48.9,45.09 46.99,43.18 v46.74,43.12 46.74,33.99 R14.2 47.94,32.78 C19.2 50.04,31.88 50.67,31.88 51.56,30.99 51.56,28.19 51.05,27.69 46.35,27.69 45.59,26.92 v45.59,22.86 | v31.75,34.29 33.02,35.43 33.02,36.2 U$4.34 | U$4.2 24.23,33.81 24.51,33.53 24.51,32.89 v25.53,32 26.53,31 U$4.14
  Top 0.406: v4.57,5.02 1.02,8.57 1.02,43.81 v2.54,45.34 | L2.2 46.91,12.7 44.96,12.7 42.61,10.35 C6.1 42.29,9.46 v42.29,7.87 42.35,7.81 v42.35,1.59 | U$4.14 26.53,22.98 24.38,20.83 24.38,16.38 25.53,15.24 31.24,15.24 v32.26,14.22 32.38,14.22 32.64,14.35 v35.69,14.35
  Bottom 0.203: v2.54,45.34 2.73,45.53 R8.1 2.73,49.6 3.3,50.16 4.32,50.16 4.63,50.48 R11.2 6.03,52.83 R10.1 R12.2 | v31.75,34.29 31.75,32.64 30.92,31.81 R15.2 30.1,31.84 30.1,32.77 29.72,33.15 25.91,33.15 25.53,32.77 v25.53,32 | v42.29,7.87 42.29,19.56 v45.59,22.86
  Bottom 0.406: v42.35,1.59 41.78,1.91 7.94,1.91 4.83,5.02 v4.57,5.02 | v42.29,7.87 40.46,9.7 39.96,9.7 R2.2 39.86,10.01 39.86,12.33 37.85,14.35 v35.69,14.35 35.69,12.36 R9.1 | R7.2 31.68,18.29 Q2.2 31.88,15.89 v32.26,14.22
ENLCD  (via drill 0.41)
  Top 0.203: U$4.22 34.5,24.81 v34.54,24.77
  Bottom 0.203: v34.54,24.77 30.35,20.57 27.18,20.57 25.4,19.43 25.4,16.89 25.84,16.45 R6.2
ENREG  (via drill 0.41)
  Top 0.203: U$4.38 29.73,34.81 v29.59,34.67 | v11.3,34.16 11.27,34.13 IC3.3
  Bottom 0.203: v29.59,34.67 28.96,35.31 12.45,35.31 v11.3,34.16
GND  (via drill 0.41)
  Top 0.203: 7.11,51.31 S2.1 10.29,51.31 S3.1 | 34.92,26.67 U$4.23 | 25.88,36.35 U$4.43 | 32.07,36.35 U$4.35 | 12.54,9.05 X4.5 | v42.55,36.2 42.55,37.08 U$3.7
  Top 0.305: 25.74,36.45 U$4.43
  Bottom 0.203: 12.54,14.92 12.53,14.91 | 53.34,36.2 U1.41 | U1.41 | U1.22 42.23,53.82 U1.22 | 35.72,37.47 U1.8 | 47.45,53.85 47.62,53.98 U1.26 | U1.27 48.26,53.98 48.26,53.85 | U1.41 53.66,36.04 U1.41 | U1.26 47.31,53.82 47.31,53.98 U1.26 | U1.22 42.23,53.98 U1.22 | 35.88,28.42 35.81,28.42 | U1.1 | 35.88,28.42 U1.1 | U1.1 35.88,28.57 35.88,28.42 | v42.55,36.2 41.27,37.47 36.2,37.47
  other vias: 18.8,13.21 32.64,38.1
  pour Bottom: 34.29,26.92 34.8,57.02 55.12,57.02 55.12,27.05
  pour Top: 22.86,0 22.86,14.35 19.43,14.35 19.43,21.34 24.26,21.34 24.26,16.26 33.78,16.26 33.78,0 59.18,0 59.18,58.04 0,58.04 0,0
  pour Bottom: 22.86,0 22.86,14.35 19.43,14.35 19.43,21.34 33.78,21.34 33.78,0 59.18,0 59.18,58.04 0,58.04 0,0
HWB
  Top 0.203: U$4.33 34.73,37.66 33.3,39.09 R3.2 32.74,39.65
IEXC  (via drill 0.41)
  Top 0.203: v23.37,9.91 21.59,11.68 17.4,11.68 17.14,11.94 17.14,24.26 16.68,24.72 Q1.3
  Bottom 0.203: v23.37,9.91 JP4.5
ISP+5V  (via drill 0.41)
  Top 0.203: 40.89,27.69 v40.77,27.69 43.28,25.17 D2.A | CON1.5V v23.85,40.26
  Bottom 0.203: v40.77,27.69 40.39,27.31 33.53,27.31 32.89,27.95 32.89,34.42 31.62,35.69 24.38,35.69 23.85,36.22 v23.85,40.26
LCDVCC
  Bottom 0.406: Q2.3 30.73,10.79 33.66,8 35.43,8 36.06,7.37 JP3.P3
MISO  (via drill 0.41)
  Top 0.203: 22.67,26.61 U$4.11 22.29,26.61 20.95,27.94 15.49,27.94 14.99,28.45 14.99,38.99 17.02,41.02 17.02,45.59 18.16,46.73 19.55,46.73 19.55,46.74 20.83,46.74 v21.59,45.97 21.59,44.45 20.83,43.69 20.83,40.64 CON1.MISO
  Bottom 0.203: v21.59,45.97 28.07,45.97 28.43,46.46 29.31,46.5 | 29.21,46.35 29.31,46.5 | 29.31,46.5 IC4.P$13
MOSI  (via drill 0.41)
  Top 0.203: U$4.10 22.25,27.41 21.36,28.3 15.78,28.3 15.37,28.71 15.37,38.73 17.91,41.27 v17.91,45.21 | CON1.MOSI 24.51,38.99 25.02,39.5 v25.02,45.09
  Bottom 0.203: IC4.P$14 29.21,45.09 v25.02,45.09 18.29,45.09 18.16,45.21 v17.91,45.21
N$1
  Top 0.406: L1.1 L2.1 49.58,16.68 51.44,18.54 51.44,20.43 F1.2
N$2  (via drill 0.41)
  Top 0.203: v18.23,16.96 18.19,16.96 17.5,17.65 17.5,24.49 17.82,24.81 Q1.1 | v22.61,16.64 IC2.1
  Bottom 0.203: v18.23,16.96 22.28,16.96 v22.61,16.64
N$3
  Top 0.203: U$3.8 49.15,36.02 R14.1
N$4  (via drill 0.41)
  Top 0.203: v22.61,19.18 IC2.3 | R5.2 R4.1 15.11,22.48 v15.75,21.84
  Bottom 0.203: v15.75,21.84 18.41,19.18 v22.61,19.18
N$5
  Top 0.203: IC2.2 19.05,17.91 18.54,18.41 18.54,20.83 18.8,21.08 20.32,21.08 20.64,21.4 R1.1 20.64,24.98 Q1.2
N$6
  Top 0.203: IC3.4 C12.1
N$7
  Bottom 0.203: R6.1 29.34,18.35 R7.1 29.78,18.29 Q2.1
N$8
  Top 0.203: IC2.7 IC2.6
NSS  (via drill 0.41)
  Top 0.203: U$4.8 16.33,29.01 16.13,29.21 16.13,37.08 18.92,39.88 v18.92,43.94
  Bottom 0.203: v18.92,43.94 27.05,43.94 28.11,42.88 IC4.P$15
ONE-WIRE  (via drill 0.41)
  Top 0.203: 34.92,33.66 U$4.32 35.71,33.81 35.94,34.04 35.94,53.21 35.31,53.85 v21.46,53.85 | v2.41,41.53 3.17,42.29 3.17,43.31 3.81,43.94 9.78,43.94 11.05,45.21 14.55,45.21 15.75,46.41 v15.75,48.13
  Bottom 0.203: JP4.10 19.43,4.95 18.52,4.04 8.53,4.04 3.94,8.64 U$9.2 3.94,22.99 3.91,22.99 U$5.2 U$6.2 3.91,41.18 R17.2 | R17.2 4,41.85 | v2.41,41.53 2.67,41.27 R17.2 | v15.75,48.13 v21.46,53.85
RD_N  (via drill 0.41)
  Top 0.203: v8.13,32.77 8.13,17.91 11.05,14.99 R31.1 | U$4.3 22.86,33.02 21.03,33.02 v21.01,32.99
  Bottom 0.203: v21.01,32.99 20.14,32.13 14.86,32.13 14.25,32.74 8.28,32.74 v8.13,32.77
RD_P  (via drill 0.41)
  Top 0.203: v9.14,31.62 9.14,17.53 11.05,15.62 12.7,15.62 13.16,15.16 R24.1 | v21.74,32.13 23.05,32.13 U$4.4
  Bottom 0.203: v9.14,31.62 9.91,32.38 14.1,32.38 14.73,31.75 21.08,31.75 21.46,32.13 v21.74,32.13
RST  (via drill 0.41)
  Top 0.203: U$4.13 25.72,24.77 25.72,30.42 v25.65,30.48 | v20.32,34.29 21.21,34.29 21.72,34.8 21.72,37.21 CON1.RESET 19.05,37.72 SJ3.2
  Bottom 0.203: 55.99,47.5 RRST.2 | RRST.2 53.66,47.43 U1.32 44.83,47.5 35.85,56.48 27.59,56.48 24.42,53.31 20.64,49.62 17.94,46.93 14.1,46.93 14.1,46.86 13.61,46.86 IC4.P$4 | RRST.2 56.96,47.43 57.28,47.12 57.28,29.84 54.01,26.57 32.48,26.57 30.1,28.96 30.1,29.89 R15.1 30.45,29.86 C9.1 27.37,30.48 v25.65,30.48 | v25.65,30.48 25.82,30.48 | v25.65,30.48 21.84,34.29 v20.32,34.29
RX  (via drill 0.41)
  Top 0.203: 51.05,41.4 51.05,41.78 | 51.05,41.78 51.05,42.55 50.09,43.51 U$3.13 | U$4.20 31.33,24.17 31.77,23.72 32.15,23.34 34.7,23.34 35.81,22.23 v35.81,20.95 | U$3.12 50.22,42.24 50.67,41.78 | 50.67,41.78 50.86,41.59 | 50.86,41.59 51.05,41.4 | 50.86,41.59 51.05,41.78 | 50.67,41.78 51.05,41.78 | v48.26,24.13 50.29,24.13 53.21,26.29 53.21,33.78 51.05,35.94 51.05,41.4
  Bottom 0.203: v48.26,24.13 40.39,24.13 37.21,20.95 v35.81,20.95
RX2  (via drill 0.41)
  Top 0.203: U$3.3 41.83,42.24 v41.15,42.93 | v45.85,41.66 v45.85,36.07
  Bottom 0.203: v41.15,42.93 42.42,41.66 v45.85,41.66 | v45.85,36.07 45.85,33.27 47.75,31.37 JP5.3
RX3  (via drill 0.41)
  Top 0.203: v42.55,34.92 44.45,36.83 44.45,42.67 43.61,43.51 U$3.2
  Bottom 0.203: v42.55,34.92 36.2,34.92 U1.6
SCK  (via drill 0.41)
  Top 0.203: 23.02,28.26 U$4.9 22.21,28.21 21.77,28.65 16.05,28.65 15.75,28.96 15.75,38.1 17.78,40.13 v18.03,40.13 | CON1.SCK 20.7,38.99 19.84,39.85 v19.84,40.13 19.84,45.95 v19.81,45.97
  Bottom 0.203: IC4.P$12 28.94,48.88 26.92,46.86 20.32,46.86 19.81,46.35 v19.81,45.97 | v18.03,40.13 v19.84,40.13
SCL  (via drill 0.41)
  Top 0.203: 29.84,24.77 U$4.18 29.73,24.12 32.77,21.08 v33.53,21.08
  Bottom 0.203: v33.53,21.08 33.53,10.54 33.79,10.28 R9.2 35.51,9.45 36.83,8.13 37.59,8.13 38.06,7.66 JP3.P2
SDA  (via drill 0.41)
  Top 0.203: 30.48,25.4 30.52,24.89 | 30.52,24.89 U$4.19 | U$4.19 30.48,24.77 | U$4.19 30.53,24.25 | v34.54,22.23 32.43,22.23 30.52,24.13 30.52,24.89 | v34.54,15.62 36.07,15.62 37.72,13.97 v37.72,11.81
  Bottom 0.203: v34.54,22.23 v34.54,15.62 | v37.72,11.81 37.72,10.05 R2.1 37.86,9.13 38.86,8.13 39.62,8.13 40.06,7.69 JP3.P1
TX  (via drill 0.41)
  Top 0.203: U$4.21 32.13,23.88 32.26,23.75 34.89,23.75 36.7,21.93 v36.7,21.84 | 50.67,39.5 50.67,40.51 50.22,40.97 U$3.11 | 50.67,39.5 50.67,39.12 | U$3.10 50.09,39.7 50.29,39.5 | 50.29,39.5 50.42,39.37 | 50.42,39.37 50.67,39.12 | 50.55,39.5 50.29,39.5 | 50.67,39.5 50.55,39.5 | 50.55,39.5 50.42,39.37 | v47.75,25.27 51.18,25.27 52.83,26.55 52.83,33.53 50.67,35.69 50.67,39.12
  Bottom 0.203: v47.75,25.27 46.74,24.51 46.72,24.53 40.13,24.53 37.44,21.84 v36.7,21.84
TX2  (via drill 0.41)
  Top 0.203: U$3.5 42.11,39.7 41.4,38.99 41.4,35.2 41.4,34.95 41.65,34.68 v43.94,32.38
  Bottom 0.203: v43.94,32.38 45.21,31.11 JP5.2
TX3  (via drill 0.41)
  Top 0.203: v40.64,36.2 40.64,39.62 42.04,41.02 42.09,40.97 U$3.4
  Bottom 0.203: v40.64,36.2 36.2,36.2 U1.7
UCAP
  Top 0.203: C3.2 23.08,30.66 U$4.6
V_USB  (via drill 0.41)
  Top 0.203: U$4.7 23.5,29.84 v24.77,29.84 | v7.27,25.37 7.27,16.86 8.9,15.23 C7.2 9.2,14.03 X4.1
  Bottom 0.203: D4.A 50.7,20.8 49.53,21.97 49.53,25.44 48.66,26.18 47.23,26.18 46.82,25.78 32.64,25.78 29.84,28.57 27.05,28.57 25.91,29.84 v24.77,29.84 24.77,26.92 22.86,24.77 7.68,24.77 v7.27,25.37
VANALOG  (via drill 0.41)
  Top 0.203: U$4.37 30.53,28.75 v29.46,27.69
  Bottom 0.203: v29.46,27.69 29.46,21.84 28.96,21.34 26.29,21.34 24.89,20.07 24.89,12.45 21.97,10.16 JP4.7
VCC  (via drill 0.41)
  Top 0.406: v51.49,12.57 52.32,11.73 v52.32,3.11 | v47.12,22.86 47.12,20.69 F1.1 43.84,20.45 D2.C 43.03,20.14 C10.1 | 4.45,35.62 C11.1 4.51,34.73 5.11,34.13 6.38,34.13 | IC3.1 7.34,34.13 | 7.34,34.13 6.86,33.66 | 6.86,33.66 6.86,27.56 6.22,26.92 6.22,24.64 6.6,24.26 6.6,17.4 3.81,16 v3.81,7.11 | 6.38,34.13 7.34,34.13 | 6.86,33.66 6.38,34.13
  Bottom 0.406: 50.89,16.95 D4.C | J2.2 49.23,10.49 D3.C v51.49,12.57 51.49,16.36 D4.C | v47.12,22.86 47.12,20.73 D4.C | v3.81,7.11 8.32,2.6 49.09,2.6 49.59,3.11 v52.32,3.11 57.59,3.11 58.17,3.81 58.17,9.26 57.39,10.03 J1.2
VDD
  Bottom 0.203: D3.A 51.49,7.42
  Bottom 0.406: JP2.P1 50.01,6.02 D3.A
VOUT+  (via drill 0.41)
  Top 0.203: U$4.41 27.33,47.22 23.62,50.93 17.91,50.93 17.53,51.31 17.53,56.52 17.27,56.77 2.79,56.77 v2.03,56.01 | v28.32,3.81 28.32,3.41 v25.91,1.12
  Bottom 0.203: v28.32,3.81 28.32,8.26 27.81,8.76 JP4.3 | v25.91,1.12 25.53,1.4 6.98,1.4 1.14,7.23 1.14,55.12 v2.03,56.01
VOUT-  (via drill 0.41)
  Top 0.203: U$4.40 28.13,37.53 27.69,37.97 27.69,47.37 23.75,51.3 23.37,51.31 18.16,51.31 17.91,51.56 17.91,56.77 17.53,57.15 1.65,57.15 v1.27,56.77 | v26.54,3.81 26.54,3.17 24.13,0.76 v22.35,0.76
  Bottom 0.203: v22.35,0.76 7.11,0.76 0.76,7.11 0.76,56.26 v1.27,56.77 | JP4.4 27.05,4.32 v26.54,3.81
VSENSORS  (via drill 0.41)
  Top 0.203: v24.13,22.99 24.13,24.13 24.77,24.77 U$4.12
  Bottom 0.203: v24.13,22.99 22.86,24.38 6.22,24.38 5.52,23.69 | JP4.9 18.41,9.78 9.91,9.78 8,12.06 8,17.27 5.21,20.07 U$9.1 | R17.1 5.9,39.56 U$6.1 U$5.1 5.21,31.32 5.21,23.75 | U$9.1 5.21,23.75 | 5.52,23.69 5.21,23.37 U$9.1 | 5.21,23.75 5.27,23.69 5.52,23.69
XTAL1
  Top 0.203: U$4.17 28.93,23.65 29.93,22.65 R13.2 31.18,20.7 32,20.7 34.31,18.39 X3.P$2 34.81,18.63 C8.2
XTAL2
  Top 0.203: 29.34,18.54 29.34,19.94 28.03,21.25 R13.1 28.13,21.66 U$4.16 | 29.34,18.54 X3.P$1 | C2.2 28.69,19.19 29.34,18.54

### Text on the board
tNames: StandTransducer V1.0 | GND | DQ | VCC | 1 | GND | DQ | VCC | GND | DQ | VCC
Document: Standard Tranducer Version 1.0 | This Designs ARE PROVIDED "AS IS" AND "WITH ALL FAULTS. Andres Vargas DISCLAIMS ALL / OTHER WARRANTIES, EXPRESS OR IMPLIED, REGARDING PRODUCTS, INCLUDING BUT / NOT LIMITED TO, ANY IMPLIED WARRANTIES OF MERCHANTABILITY OR FITNESS FOR A / PARTICULAR PURPOSE. | Universidad del Valle may make changes to specifications and product descriptions at any time, / without notice. The Customer must not rely on the absence or characteristics of any features or / instructions marked "reserved" or "undefined." Andres Vargas reserves these for future definition / and shall have no responsibility whatsoever for conflicts or incompatibilities arising from future / changes to them. The product information or Materials is subject to change without notice. Do not / finalize a design with this information.
Reference: This designs was developed under undergraduate thesis from Andres Vargas in the School of / Electrical and Electronic Engineering of Universidad del Valle, Cali - Colombia. 2018.